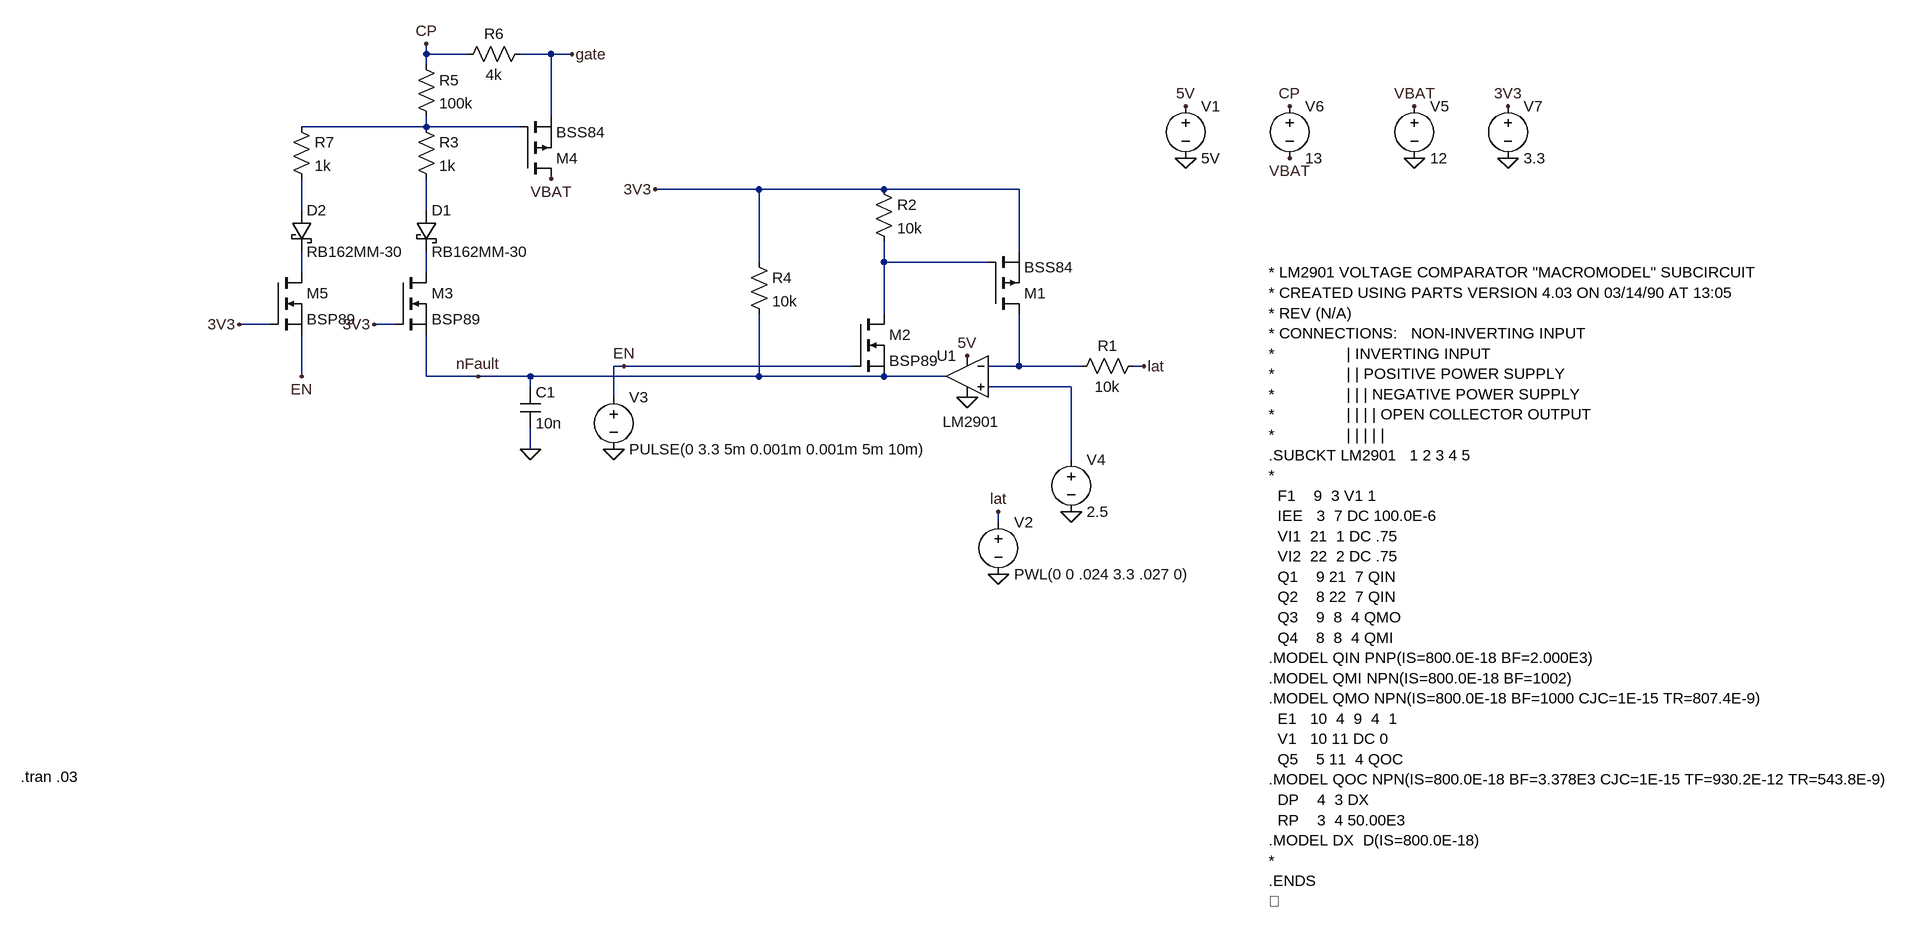
[diagram p0: schematic Efuse_Latch.asc]
Efuse_Latch.asc, the LTspice schematic file:
Version 4
SHEET 1 2828 680
WIRE 576 -544 576 -560
WIRE 640 -544 576 -544
WIRE 768 -544 720 -544
WIRE 800 -544 768 -544
WIRE 576 -528 576 -544
WIRE 768 -448 768 -544
WIRE 576 -432 576 -448
WIRE 576 -432 384 -432
WIRE 720 -432 576 -432
WIRE 1088 -336 928 -336
WIRE 1280 -336 1088 -336
WIRE 1488 -336 1280 -336
WIRE 384 -304 384 -352
WIRE 576 -304 576 -352
WIRE 1488 -240 1488 -336
WIRE 1088 -224 1088 -336
WIRE 1280 -224 1280 -256
WIRE 1440 -224 1280 -224
WIRE 384 -208 384 -240
WIRE 576 -208 576 -240
WIRE 1280 -144 1280 -224
WIRE 336 -128 288 -128
WIRE 528 -128 496 -128
WIRE 880 -64 864 -64
WIRE 1232 -64 880 -64
WIRE 1488 -64 1488 -144
WIRE 1488 -64 1440 -64
WIRE 1584 -64 1488 -64
WIRE 1680 -64 1664 -64
WIRE 384 -48 384 -112
WIRE 576 -48 576 -112
WIRE 656 -48 576 -48
WIRE 736 -48 656 -48
WIRE 1088 -48 1088 -144
WIRE 1088 -48 736 -48
WIRE 1280 -48 1088 -48
WIRE 1376 -48 1280 -48
WIRE 736 -32 736 -48
WIRE 1568 -32 1440 -32
WIRE 864 -16 864 -64
WIRE 736 64 736 32
WIRE 1568 80 1568 -32
WIRE 1456 176 1456 160
FLAG 1744 -384 0
FLAG 1744 -464 5V
FLAG 1456 256 0
FLAG 1456 160 lat
FLAG 1408 -80 5V
FLAG 1408 -16 0
FLAG 1568 160 0
FLAG 1680 -64 lat
FLAG 864 64 0
FLAG 656 -48 nFault
FLAG 2096 -384 0
FLAG 2096 -464 VBAT
FLAG 576 -560 CP
FLAG 880 -64 EN
FLAG 1904 -464 CP
FLAG 800 -544 gate
FLAG 768 -352 VBAT
FLAG 1904 -384 VBAT
FLAG 2240 -384 0
FLAG 2240 -464 3V3
FLAG 288 -128 3V3
FLAG 384 -48 EN
FLAG 928 -336 3V3
FLAG 496 -128 3V3
FLAG 736 64 0
SYMBOL voltage 1744 -480 R0
WINDOW 123 0 0 Left 2
WINDOW 39 0 0 Left 2
SYMATTR InstName V1
SYMATTR Value 5V
SYMBOL voltage 1456 160 R0
WINDOW 123 0 0 Left 2
WINDOW 39 0 0 Left 2
SYMATTR InstName V2
SYMATTR Value PWL(0 0 .024 3.3 .027 0)
SYMBOL Opamps\\UniversalOpamp2 1408 -48 M0
WINDOW 3 -50 70 Left 2
SYMATTR Value LM2901
SYMATTR InstName U1
SYMATTR SpiceModel ""
SYMATTR Value2 ""
SYMATTR SpiceLine ""
SYMATTR SpiceLine2 ""
SYMBOL voltage 1568 64 R0
WINDOW 123 0 0 Left 2
WINDOW 39 0 0 Left 2
SYMATTR InstName V4
SYMATTR Value 2.5
SYMBOL res 1072 -240 R0
SYMATTR InstName R4
SYMATTR Value 10k
SYMBOL res 1680 -80 R90
WINDOW 0 0 56 VBottom 2
WINDOW 3 32 56 VTop 2
SYMATTR InstName R1
SYMATTR Value 10k
SYMBOL pmos 1440 -144 M180
SYMATTR InstName M1
SYMATTR Value BSS84
SYMBOL res 1264 -352 R0
SYMATTR InstName R2
SYMATTR Value 10k
SYMBOL nmos 1232 -144 R0
SYMATTR InstName M2
SYMATTR Value BSP89
SYMBOL voltage 864 -32 R0
WINDOW 123 0 0 Left 2
WINDOW 39 0 0 Left 2
SYMATTR InstName V3
SYMATTR Value PULSE(0 3.3 5m 0.001m 0.001m 5m 10m)
SYMBOL nmos 528 -208 R0
SYMATTR InstName M3
SYMATTR Value BSP89
SYMBOL res 560 -448 R0
SYMATTR InstName R3
SYMATTR Value 1k
SYMBOL res 560 -544 R0
SYMATTR InstName R5
SYMATTR Value 100k
SYMBOL voltage 2096 -480 R0
WINDOW 123 0 0 Left 2
WINDOW 39 0 0 Left 2
SYMATTR InstName V5
SYMATTR Value 12
SYMBOL pmos 720 -352 M180
SYMATTR InstName M4
SYMATTR Value BSS84
SYMBOL voltage 1904 -480 R0
WINDOW 123 0 0 Left 2
WINDOW 39 0 0 Left 2
SYMATTR InstName V6
SYMATTR Value 13
SYMBOL res 736 -560 R90
WINDOW 0 0 56 VBottom 2
WINDOW 3 32 56 VTop 2
SYMATTR InstName R6
SYMATTR Value 4k
SYMBOL nmos 336 -208 R0
SYMATTR InstName M5
SYMATTR Value BSP89
SYMBOL res 368 -448 R0
SYMATTR InstName R7
SYMATTR Value 1k
SYMBOL voltage 2240 -480 R0
WINDOW 123 0 0 Left 2
WINDOW 39 0 0 Left 2
SYMATTR InstName V7
SYMATTR Value 3.3
SYMBOL schottky 560 -304 R0
SYMATTR InstName D1
SYMATTR Value RB162MM-30
SYMATTR Description Diode
SYMATTR Type diode
SYMBOL schottky 368 -304 R0
SYMATTR InstName D2
SYMATTR Value RB162MM-30
SYMATTR Description Diode
SYMATTR Type diode
SYMBOL cap 720 -32 R0
SYMATTR InstName C1
SYMATTR Value 10n
TEXT -48 568 Left 2 !.tran .03
TEXT 1872 -208 Left 2 !* LM2901 VOLTAGE COMPARATOR "MACROMODEL" SUBCIRCUIT\n* CREATED USING PARTS VERSION 4.03 ON 03/14/90 AT 13:05\n* REV (N/A)\n* CONNECTIONS:   NON-INVERTING INPUT\n*                | INVERTING INPUT\n*                | | POSITIVE POWER SUPPLY\n*                | | | NEGATIVE POWER SUPPLY\n*                | | | | OPEN COLLECTOR OUTPUT\n*                | | | | |\n.SUBCKT LM2901   1 2 3 4 5\n*\n  F1    9  3 V1 1\n  IEE   3  7 DC 100.0E-6\n  VI1  21  1 DC .75\n  VI2  22  2 DC .75\n  Q1    9 21  7 QIN\n  Q2    8 22  7 QIN\n  Q3    9  8  4 QMO\n  Q4    8  8  4 QMI\n.MODEL QIN PNP(IS=800.0E-18 BF=2.000E3)\n.MODEL QMI NPN(IS=800.0E-18 BF=1002)\n.MODEL QMO NPN(IS=800.0E-18 BF=1000 CJC=1E-15 TR=807.4E-9)\n  E1   10  4  9  4  1\n  V1   10 11 DC 0\n  Q5    5 11  4 QOC\n.MODEL QOC NPN(IS=800.0E-18 BF=3.378E3 CJC=1E-15 TF=930.2E-12 TR=543.8E-9)\n  DP    4  3 DX\n  RP    3  4 50.00E3\n.MODEL DX  D(IS=800.0E-18)\n*\n.ENDS\n

The netlist it stands for:
* Efuse_Latch.asc
V1 5V 0 5V
V2 lat 0 PWL(0 0 .024 3.3 .027 0)
XU1 N008 N007 5V 0 nFault LM2901  ; pins IN+ IN- V+ V- OUT
V4 N008 0 2.5
R4 3V3 nFault 10k
R1 lat N007 10k
M1 N007 N004 3V3 3V3 BSS84
R2 3V3 N004 10k
M2 N004 EN nFault nFault BSP89
V3 EN 0 PULSE(0 3.3 5m 0.001m 0.001m 5m 10m)
M3 N006 3V3 nFault nFault BSP89
R3 N001 N003 1k
R5 CP N001 100k
V5 VBAT 0 12
M4 VBAT N001 gate gate BSS84
V6 CP VBAT 13
R6 gate CP 4k
M5 N005 3V3 EN EN BSP89
R7 N001 N002 1k
V7 3V3 0 3.3
D1 N003 N006 RB162MM-30
D2 N002 N005 RB162MM-30
C1 nFault 0 10n
.model D D
.lib standard.dio
.model NMOS NMOS
.model PMOS PMOS
.lib standard.mos
.tran .03
* LM2901 VOLTAGE COMPARATOR "MACROMODEL" SUBCIRCUIT
* CREATED USING PARTS VERSION 4.03 ON 03/14/90 AT 13:05
* REV (N/A)
* CONNECTIONS:   NON-INVERTING INPUT
*                | INVERTING INPUT
*                | | POSITIVE POWER SUPPLY
*                | | | NEGATIVE POWER SUPPLY
*                | | | | OPEN COLLECTOR OUTPUT
*                | | | | |
.SUBCKT LM2901   1 2 3 4 5
*
  F1    9  3 V1 1
  IEE   3  7 DC 100.0E-6
  VI1  21  1 DC .75
  VI2  22  2 DC .75
  Q1    9 21  7 QIN
  Q2    8 22  7 QIN
  Q3    9  8  4 QMO
  Q4    8  8  4 QMI
.MODEL QIN PNP(IS=800.0E-18 BF=2.000E3)
.MODEL QMI NPN(IS=800.0E-18 BF=1002)
.MODEL QMO NPN(IS=800.0E-18 BF=1000 CJC=1E-15 TR=807.4E-9)
  E1   10  4  9  4  1
  V1   10 11 DC 0
  Q5    5 11  4 QOC
.MODEL QOC NPN(IS=800.0E-18 BF=3.378E3 CJC=1E-15 TF=930.2E-12 TR=543.8E-9)
  DP    4  3 DX
  RP    3  4 50.00E3
.MODEL DX  D(IS=800.0E-18)
*
.ENDS

.lib UniversalOpamps2.sub
.backanno
.end